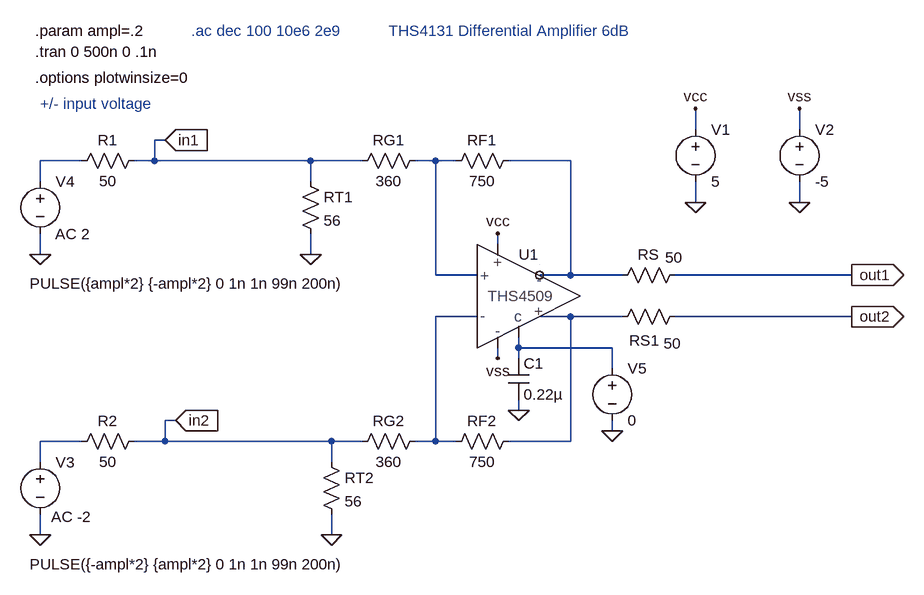
[diagram p0: schematic THS4131_test1.asc]
THS4131_test1.asc, the LTspice schematic file:
Version 4
SHEET 1 880 780
WIRE 368 -96 368 -128
WIRE 528 -96 528 -128
WIRE -448 -80 -464 -80
WIRE -576 -48 -640 -48
WIRE -464 -48 -464 -80
WIRE -464 -48 -496 -48
WIRE -224 -48 -464 -48
WIRE -144 -48 -224 -48
WIRE -32 -48 -64 -48
WIRE 0 -48 -32 -48
WIRE 176 -48 80 -48
WIRE -640 -16 -640 -48
WIRE -224 -16 -224 -48
WIRE 368 16 368 -16
WIRE 528 16 528 -16
WIRE 64 80 64 64
WIRE -640 96 -640 64
WIRE -224 96 -224 64
WIRE -32 128 -32 -48
WIRE 32 128 -32 128
WIRE 176 128 176 -48
WIRE 176 128 128 128
WIRE 256 128 176 128
WIRE 608 128 336 128
WIRE 32 192 -32 192
WIRE 176 192 128 192
WIRE 256 192 176 192
WIRE 608 192 336 192
WIRE 96 240 96 224
WIRE 240 240 96 240
WIRE 64 256 64 240
WIRE 96 256 96 240
WIRE 240 272 240 240
WIRE 96 336 96 320
WIRE -432 352 -448 352
WIRE 240 368 240 352
WIRE -576 384 -640 384
WIRE -448 384 -448 352
WIRE -448 384 -496 384
WIRE -192 384 -448 384
WIRE -144 384 -192 384
WIRE -32 384 -32 192
WIRE -32 384 -64 384
WIRE 0 384 -32 384
WIRE 176 384 176 192
WIRE 176 384 80 384
WIRE -640 416 -640 384
WIRE -192 416 -192 384
WIRE -640 528 -640 496
WIRE -192 528 -192 496
FLAG 368 16 0
FLAG 528 16 0
FLAG 368 -128 vcc
FLAG 528 -128 vss
FLAG 64 64 vcc
FLAG 64 256 vss
FLAG -192 528 0
FLAG -640 528 0
FLAG 608 128 out1
IOPIN 608 128 Out
FLAG -432 352 in2
IOPIN -432 352 In
FLAG -224 96 0
FLAG -640 96 0
FLAG -448 -80 in1
IOPIN -448 -80 In
FLAG 608 192 out2
IOPIN 608 192 Out
FLAG 96 336 0
FLAG 240 368 0
SYMBOL voltage 368 -112 R0
SYMATTR InstName V1
SYMATTR Value 5
SYMBOL voltage 528 -112 R0
SYMATTR InstName V2
SYMATTR Value -5
SYMBOL res -16 -32 R270
WINDOW 0 32 56 VTop 0
WINDOW 3 0 56 VBottom 0
SYMATTR InstName RF1
SYMATTR Value 750
SYMBOL res -160 -32 R270
WINDOW 0 32 56 VTop 0
WINDOW 3 0 56 VBottom 0
SYMATTR InstName RG1
SYMATTR Value 360
SYMBOL res -208 400 R0
SYMATTR InstName RT2
SYMATTR Value 56
SYMBOL res -592 400 R270
WINDOW 0 32 56 VTop 0
WINDOW 3 0 56 VBottom 0
SYMATTR InstName R2
SYMATTR Value 50
SYMBOL voltage -640 400 R0
WINDOW 3 -16 173 Left 0
WINDOW 123 17 100 Left 0
WINDOW 39 0 0 Left 0
SYMATTR Value PULSE({-ampl*2} {ampl*2} 0 1n 1n 99n 200n)
SYMATTR Value2 AC -2
SYMATTR InstName V3
SYMBOL res 240 144 R270
WINDOW 0 32 56 VTop 0
WINDOW 3 59 95 VBottom 0
SYMATTR InstName RS
SYMATTR Value 50
SYMBOL res -16 400 R270
WINDOW 0 32 56 VTop 0
WINDOW 3 0 56 VBottom 0
SYMATTR InstName RF2
SYMATTR Value 750
SYMBOL res -160 400 R270
WINDOW 0 32 56 VTop 0
WINDOW 3 0 56 VBottom 0
SYMATTR InstName RG2
SYMATTR Value 360
SYMBOL res -240 -32 R0
SYMATTR InstName RT1
SYMATTR Value 56
SYMBOL res -592 -32 R270
WINDOW 0 32 56 VTop 0
WINDOW 3 0 56 VBottom 0
SYMATTR InstName R1
SYMATTR Value 50
SYMBOL voltage -640 -32 R0
WINDOW 3 -16 173 Left 0
WINDOW 123 23 97 Left 0
WINDOW 39 0 0 Left 0
SYMATTR Value PULSE({ampl*2} {-ampl*2} 0 1n 1n 99n 200n)
SYMATTR Value2 AC 2
SYMATTR InstName V4
SYMBOL res 240 208 R270
WINDOW 0 -36 49 VTop 0
WINDOW 3 -10 93 VBottom 0
SYMATTR InstName RS1
SYMATTR Value 50
SYMBOL cap 80 256 R0
SYMATTR InstName C1
SYMATTR Value 0.22µ
SYMBOL THS4131 96 160 R0
SYMATTR InstName U1
SYMBOL voltage 240 256 R0
SYMATTR InstName V5
SYMATTR Value 0
TEXT -104 -248 Left 0 ;THS4131 Differential Amplifier 6dB
TEXT -648 -216 Left 0 !.tran 0 500n 0 .1n
TEXT -648 -176 Left 0 !.options plotwinsize=0
TEXT -648 -248 Left 0 !.param ampl=.2
TEXT -640 -136 Left 0 ;+/- input voltage
TEXT -408 -248 Left 0 ;.ac dec 100 10e6 2e9
CIRCLE Normal 128 112 128 112

The netlist it stands for:
* THS4131_test1.asc
V1 vcc 0 5
V2 vss 0 -5
RF1 N002 N003 750
RG1 in1 N002 360
RT2 in2 0 56
R2 N007 in2 50
V3 N007 0 PULSE({-ampl*2} {ampl*2} 0 1n 1n 99n 200n) AC -2
RS N003 out1 50
RF2 N004 N005 750
RG2 in2 N004 360
RT1 in1 0 56
R1 N001 in1 50
V4 N001 0 PULSE({ampl*2} {-ampl*2} 0 1n 1n 99n 200n) AC 2
RS1 N005 out2 50
C1 N006 0 0.22µ
XU1 N002 N004 vcc vss N005 N003 N006 THS4131  ; pins in+ in- vs+ vs- out+ out- cm
V5 N006 0 0
* THS4131 Differential Amplifier 6dB
.tran 0 500n 0 .1n
.options plotwinsize=0
.param ampl=.2
* +/- input voltage
* .ac dec 100 10e6 2e9
.lib THS4131.txt
.backanno
.end